# Altium schematic sheet audio_dsp.SchDoc
size A4
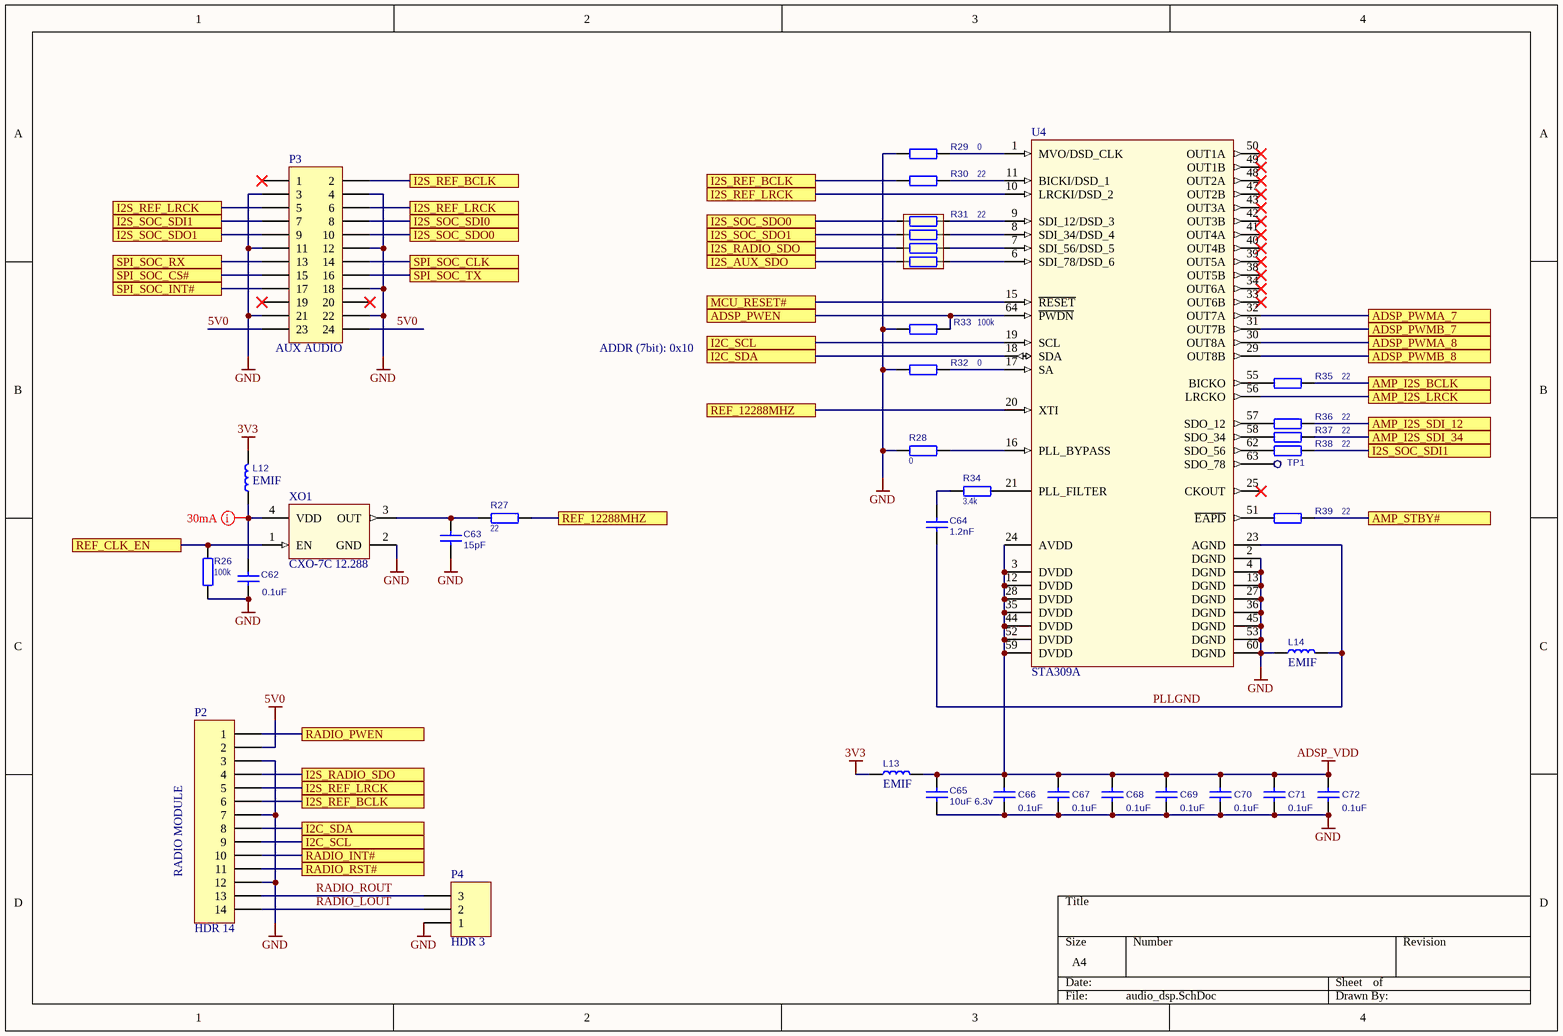
[diagram p0: audio_dsp.SchDoc]

## Parts
C62  value 0.1uF  [C0603]  (hidden comment: CC0603KRX7R9BB104)
C63  value 15pF  [C0603]  (hidden comment: CC0603GRNPO9BN150)
C64  value 1.2nF  [C0603]  (hidden comment: GRM1885C1H122JA01D)
C65  value 10uF 6.3v  [C0603]  (hidden comment: CC0603MRX5R5BB106)
C66  value 0.1uF  [C0603]  (hidden comment: CC0603KRX7R9BB104)
C67  value 0.1uF  [C0603]  (hidden comment: CC0603KRX7R9BB104)
C68  value 0.1uF  [C0603]  (hidden comment: CC0603KRX7R9BB104)
C69  value 0.1uF  [C0603]  (hidden comment: CC0603KRX7R9BB104)
C70  value 0.1uF  [C0603]  (hidden comment: CC0603KRX7R9BB104)
C71  value 0.1uF  [C0603]  (hidden comment: CC0603KRX7R9BB104)
C72  value 0.1uF  [C0603]  (hidden comment: CC0603KRX7R9BB104)
L12  value EMIF  [IND0603]  (hidden comment: BLM18AG102SN1D)
L13  value EMIF  [IND0603]  (hidden comment: BLM18AG102SN1D)
L14  value EMIF  [IND0603]  (hidden comment: BLM18AG102SN1D)
P2  HDR 14  [PLS-14]
P3  AUX AUDIO  [PLD-12]
P4  HDR 3  [PLS-3]
R26  value 100k  [R0603]  (hidden comment: 47k)
R27  22  [R0603]
R28  0  [R0603]
R29  0  [R0603]
R30  22  [R0603]
R31  value 22  [R0804X4]  (hidden comment: TC124-JR-0722RL)
R32  0  [R0603]
R33  100k  [R0603]
R34  3.4k  [R0603]
R35  22  [R0603]
R36  22  [R0603]
R37  22  [R0603]
R38  22  [R0603]
R39  22  [R0603]
TP1  TEST-POINT  [PAD]  (value not drawn)
U4  STA309A  [PM064_N]
XO1  CXO-7C 12.288  [CXO-5032]

## Ports
ADSP_PWEN, ADSP_PWMA_7, ADSP_PWMA_8, ADSP_PWMB_7, ADSP_PWMB_8, AMP_I2S_BCLK, AMP_I2S_LRCK, AMP_I2S_SDI_12, AMP_I2S_SDI_34, AMP_STBY#, I2C_SCL, I2C_SDA, I2S_AUX_SDO, I2S_RADIO_SDO, I2S_REF_BCLK, I2S_REF_LRCK, I2S_SOC_SDI0, I2S_SOC_SDI1, I2S_SOC_SDO0, I2S_SOC_SDO1, MCU_RESET#, RADIO_INT#, RADIO_PWEN, RADIO_RST#, REF_12288MHZ, REF_CLK_EN, SPI_SOC_CLK, SPI_SOC_CS#, SPI_SOC_INT#, SPI_SOC_RX, SPI_SOC_TX

## Nets
3V3: L12.1 L13.2
5V0: P2.2 P3.23 P3.24
ADSP_VDD: C65.2 C66.1 C67.1 C68.1 C69.1 C70.1 C71.1 C72.1 L13.1 U4.3(DVDD) U4.12(DVDD) U4.24(AVDD) U4.28(DVDD) U4.35(DVDD) U4.44(DVDD) U4.52(DVDD) U4.59(DVDD)
GND: C62.1 C63.2 C65.1 C66.2 C67.2 C68.2 C69.2 C70.2 C71.2 C72.2 L14.2 P2.3 P2.7 P2.12 P3.3 P3.4 P3.11 P3.12 P3.18 P3.21 P3.22 P4.1 R26.2 R28.1 R29.1 R32.1 R33.2 U4.2(DGND) U4.4(DGND) U4.13(DGND) U4.27(DGND) U4.36(DGND) U4.45(DGND) U4.53(DGND) U4.60(DGND) XO1.2(GND)
ADSP_PWEN: R33.1 U4.64(~{PWDN}) ; port ADSP_PWEN
ADSP_PWMA_7: U4.32(OUT7A) ; port ADSP_PWMA_7
ADSP_PWMA_8: U4.30(OUT8A) ; port ADSP_PWMA_8
ADSP_PWMB_7: U4.31(OUT7B) ; port ADSP_PWMB_7
ADSP_PWMB_8: U4.29(OUT8B) ; port ADSP_PWMB_8
AMP_I2S_BCLK: R35.2 ; port AMP_I2S_BCLK
AMP_I2S_LRCK: U4.56(LRCKO) ; port AMP_I2S_LRCK
AMP_I2S_SDI_12: R36.2 ; port AMP_I2S_SDI_12
AMP_I2S_SDI_34: R37.2 ; port AMP_I2S_SDI_34
AMP_STBY#: R39.2 ; port AMP_STBY#
I2C_SCL: P2.9 U4.19(SCL) ; port I2C_SCL
I2C_SDA: P2.8 U4.18(SDA) ; port I2C_SDA
I2S_AUX_SDO: R31.1 ; port I2S_AUX_SDO
I2S_RADIO_SDO: P2.4 R31.3 ; port I2S_RADIO_SDO
I2S_REF_BCLK: P2.6 P3.2 R30.1 ; port I2S_REF_BCLK
I2S_REF_LRCK: P2.5 P3.5 P3.6 U4.10(LRCKI/DSD_2) ; port I2S_REF_LRCK
I2S_SOC_SDI0: P3.8 ; port I2S_SOC_SDI0
I2S_SOC_SDI1: P3.7 R38.2 ; port I2S_SOC_SDI1
I2S_SOC_SDO0: P3.10 R31.7 ; port I2S_SOC_SDO0
I2S_SOC_SDO1: P3.9 R31.5 ; port I2S_SOC_SDO1
MCU_RESET#: U4.15(~{RESET}) ; port MCU_RESET#
PLLGND: C64.2 L14.1 U4.23(AGND)
RADIO_INT#: P2.10 ; port RADIO_INT#
RADIO_LOUT: P2.14 P4.2
RADIO_PWEN: P2.1 ; port RADIO_PWEN
RADIO_ROUT: P2.13 P4.3
RADIO_RST#: P2.11 ; port RADIO_RST#
REF_12288MHZ: R27.1 U4.20(XTI) ; port REF_12288MHZ
REF_CLK_EN: R26.1 XO1.1(EN) ; port REF_CLK_EN
SPI_SOC_CLK: P3.14 ; port SPI_SOC_CLK
SPI_SOC_CS#: P3.15 ; port SPI_SOC_CS#
SPI_SOC_INT#: P3.17 ; port SPI_SOC_INT#
SPI_SOC_RX: P3.13 ; port SPI_SOC_RX
SPI_SOC_TX: P3.16 ; port SPI_SOC_TX
NetC62_2: C62.2 L12.2 XO1.4(VDD)
NetC63_1: C63.1 R27.2 XO1.3(OUT)
NetC64_1: C64.1 R34.2
NetR28_2: R28.2 U4.16(PLL_BYPASS)
NetR29_2: R29.2 U4.1(MVO/DSD_CLK)
NetR30_2: R30.2 U4.11(BICKI/DSD_1)
NetR31_2: R31.2 U4.6(SDI_78/DSD_6)
NetR31_4: R31.4 U4.7(SDI_56/DSD_5)
NetR31_6: R31.6 U4.8(SDI_34/DSD_4)
NetR31_8: R31.8 U4.9(SDI_12/DSD_3)
NetR32_2: R32.2 U4.17(SA)
NetR34_1: R34.1 U4.21(PLL_FILTER)
NetR35_1: R35.1 U4.55(BICKO)
NetR36_1: R36.1 U4.57(SDO_12)
NetR37_1: R37.1 U4.58(SDO_34)
NetR38_1: R38.1 U4.62(SDO_56)
NetR39_1: R39.1 U4.51(~{EAPD})
NetTP1_1: TP1.1 U4.63(SDO_78)

Not connected (* = marked no-connect by the designer): P3 1* 19* 20*; U4 25(CKOUT)* 33(OUT6B)* 34(OUT6A)* 38(OUT5B)* 39(OUT5A)* 40(OUT4B)* 41(OUT4A)* 42(OUT3B)* 43(OUT3A)* 47(OUT2B)* 48(OUT2A)* 49(OUT1B)* 50(OUT1A)*

## Layout directives
mark named 30mA: NetC62_2

## Notes on the sheet
- ADDR (7bit): 0x10
- (near P2) RADIO MODULE

## Library data of the parts
C62-C72 = CAP_NPOL
L12-L14 = IND_WO_IRON
P2 = HDR 14: Header, 14-Pin; LatestRevisionDate: 17-Jul-2002; LatestRevisionNote: Re-released for DXP Platform.; Publisher: Altium Limited
P3 = HDR 12X2: Header, 12-Pin, Dual row; LatestRevisionDate: 17-Jul-2002; LatestRevisionNote: Re-released for DXP Platform.; Publisher: Altium Limited
P4 = HDR 3: Header, 3-Pin; LatestRevisionDate: 17-Jul-2002; LatestRevisionNote: Re-released for DXP Platform.; Publisher: Altium Limited
R26-R30 R32-R39 = RESISTOR: RES
  R27 R30 R35-R39: Value: 22
  R28 R29 R32: Value: 0
  R33: Value: 100k
  R34: Value: 3.4k
R31 = ARRAY
TP1 = TEST-POINT: PCB terminal block; Value: *
U4 = STA309A: Multi-channel digital audio processor with DDX®; Value: STA309A
XO1 = CXO-7C: value: CXO-7C